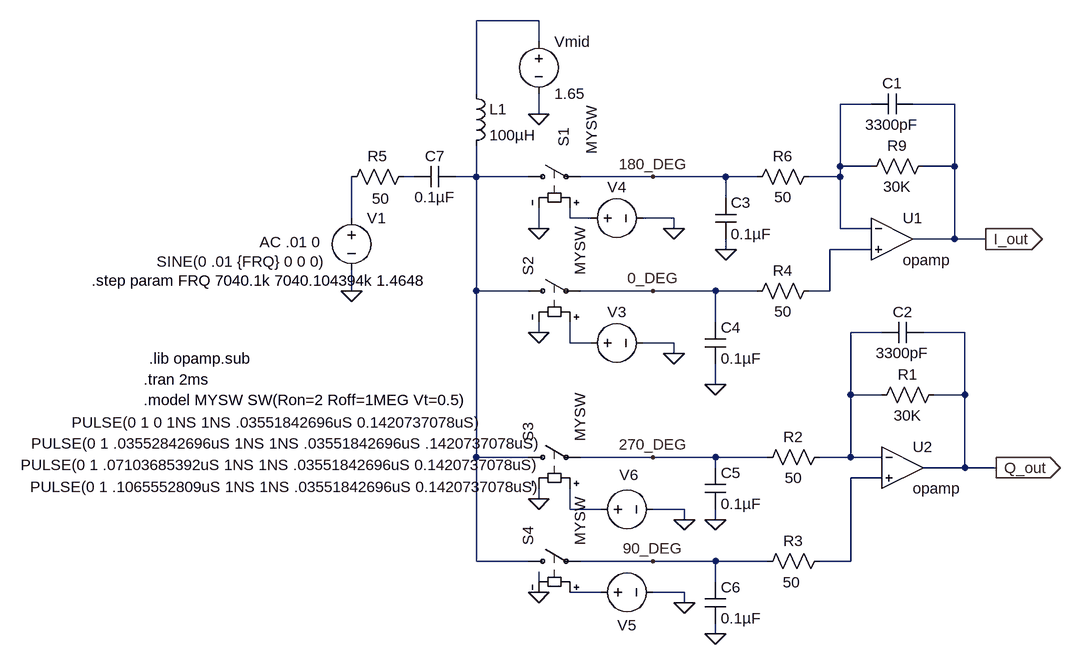
[diagram p0: schematic mixer_and_amplifier.asc]
mixer_and_amplifier.asc, the LTspice schematic file:
Version 4
SHEET 1 2336 848
WIRE -480 -288 -576 -288
WIRE -480 -256 -480 -288
WIRE -576 -176 -576 -288
WIRE 32 -160 -16 -160
WIRE 160 -160 96 -160
WIRE -480 -144 -480 -176
WIRE -16 -64 -16 -160
WIRE 32 -64 -16 -64
WIRE 160 -64 160 -160
WIRE 160 -64 112 -64
WIRE -672 -48 -688 -48
WIRE -576 -48 -576 -96
WIRE -576 -48 -608 -48
WIRE -496 -48 -576 -48
WIRE -304 -48 -416 -48
WIRE -192 -48 -304 -48
WIRE -144 -48 -192 -48
WIRE -16 -48 -16 -64
WIRE -16 -48 -64 -48
WIRE -192 -16 -192 -48
WIRE -768 16 -768 -48
WIRE -432 16 -432 0
WIRE -400 16 -432 16
WIRE -272 16 -320 16
WIRE -480 32 -480 0
WIRE -272 32 -272 16
WIRE -16 32 -16 -48
WIRE 32 32 -16 32
WIRE 160 48 160 -64
WIRE 160 48 96 48
WIRE 208 48 160 48
WIRE -192 64 -192 48
WIRE 32 64 -32 64
WIRE -768 128 -768 96
WIRE -576 128 -576 -48
WIRE -496 128 -576 128
WIRE -304 128 -416 128
WIRE -208 128 -304 128
WIRE -144 128 -208 128
WIRE -32 128 -32 64
WIRE -32 128 -64 128
WIRE -208 176 -208 128
WIRE -480 192 -480 176
WIRE 48 192 0 192
WIRE 176 192 112 192
WIRE -432 208 -432 176
WIRE -400 208 -432 208
WIRE -272 208 -320 208
WIRE -272 224 -272 208
WIRE -208 272 -208 240
WIRE 0 288 0 192
WIRE 48 288 0 288
WIRE 176 288 176 192
WIRE 176 288 128 288
WIRE -576 384 -576 128
WIRE -496 384 -576 384
WIRE -304 384 -416 384
WIRE -208 384 -304 384
WIRE -128 384 -208 384
WIRE 0 384 0 288
WIRE 0 384 -48 384
WIRE 48 384 0 384
WIRE -208 400 -208 384
WIRE 176 400 176 288
WIRE 176 400 112 400
WIRE 224 400 176 400
WIRE 48 416 0 416
WIRE -480 448 -480 432
WIRE -432 464 -432 432
WIRE -384 464 -432 464
WIRE -256 464 -304 464
WIRE -256 480 -256 464
WIRE -208 480 -208 464
WIRE -576 544 -576 384
WIRE -496 544 -576 544
WIRE -304 544 -416 544
WIRE -208 544 -304 544
WIRE -128 544 -208 544
WIRE 0 544 0 416
WIRE 0 544 -48 544
WIRE -480 576 -480 560
WIRE -208 576 -208 544
WIRE -384 592 -432 592
WIRE -256 592 -304 592
WIRE -256 608 -256 592
WIRE -208 656 -208 640
FLAG -304 128 0_DEG
FLAG -304 -48 180_DEG
FLAG -304 544 90_DEG
FLAG -304 384 270_DEG
FLAG -480 32 0
FLAG -480 192 0
FLAG -480 448 0
FLAG -480 592 0
FLAG -272 32 0
FLAG -272 224 0
FLAG -256 480 0
FLAG -256 608 0
FLAG -192 64 0
FLAG -208 272 0
FLAG -208 480 0
FLAG -208 656 0
FLAG -768 128 0
FLAG -480 -144 0
FLAG 208 48 I_out
IOPIN 208 48 Out
FLAG 224 400 Q_out
IOPIN 224 400 Out
SYMBOL res -32 368 R90
WINDOW 0 0 56 VBottom 2
WINDOW 3 32 56 VTop 2
SYMATTR InstName R2
SYMATTR Value 50
SYMATTR SpiceLine tol=1
SYMBOL res -32 528 R90
WINDOW 0 0 56 VBottom 2
WINDOW 3 33 59 VTop 2
SYMATTR InstName R3
SYMATTR Value 50
SYMATTR SpiceLine tol=1
SYMBOL res -48 112 R90
WINDOW 0 0 56 VBottom 2
WINDOW 3 32 56 VTop 2
SYMATTR InstName R4
SYMATTR Value 50
SYMATTR SpiceLine tol=1
SYMBOL res -48 -64 R90
WINDOW 0 0 56 VBottom 2
WINDOW 3 32 56 VTop 2
SYMATTR InstName R6
SYMATTR Value 50
SYMATTR SpiceLine tol=1]
SYMBOL cap 96 -176 R90
WINDOW 0 0 32 VBottom 2
WINDOW 3 32 32 VTop 2
SYMATTR InstName C1
SYMATTR Value 3300pF
SYMBOL cap -208 -16 R0
SYMATTR InstName C3
SYMATTR Value 0.1µF
SYMBOL cap -224 176 R0
SYMATTR InstName C4
SYMATTR Value 0.1µF
SYMBOL cap -224 400 R0
SYMATTR InstName C5
SYMATTR Value 0.1µF
SYMBOL cap -224 576 R0
SYMATTR InstName C6
SYMATTR Value 0.1µF
SYMBOL res 128 -80 R90
WINDOW 0 0 56 VBottom 2
WINDOW 3 32 56 VTop 2
SYMATTR InstName R9
SYMATTR Value 30K
SYMATTR SpiceLine tol=1
SYMBOL voltage -768 0 R0
WINDOW 123 -142 53 Left 2
WINDOW 39 0 0 Left 0
WINDOW 3 -300 83 Left 2
SYMATTR Value2 AC .01 0
SYMATTR Value SINE(0 .01 {FRQ} 0 0 0)
SYMATTR InstName V1
SYMBOL sw -512 -48 R270
WINDOW 3 34 113 Left 2
WINDOW 0 46 70 Left 2
SYMATTR Value MYSW
SYMATTR InstName S1
SYMBOL sw -512 128 R270
SYMATTR InstName S2
SYMATTR Value MYSW
SYMBOL sw -512 384 R270
SYMATTR InstName S3
SYMATTR Value MYSW
SYMBOL sw -512 544 R270
SYMATTR InstName S4
SYMATTR Value MYSW
SYMBOL voltage -416 208 R270
WINDOW 0 32 56 VTop 2
WINDOW 3 -107 -464 VBottom 2
WINDOW 123 0 0 Left 0
WINDOW 39 0 0 Left 0
SYMATTR InstName V3
SYMATTR Value PULSE(0 1 0 1NS 1NS .03551842696uS 0.1420737078uS)
SYMBOL voltage -416 16 R270
WINDOW 0 32 56 VTop 2
WINDOW 3 -364 -457 VBottom 2
WINDOW 123 0 0 Left 0
WINDOW 39 0 0 Left 0
SYMATTR InstName V4
SYMATTR Value PULSE(0 1 .07103685392uS 1NS 1NS .03551842696uS 0.1420737078uS)
SYMBOL voltage -400 592 R270
WINDOW 0 -66 56 VTop 2
WINDOW 3 245 -464 VBottom 2
WINDOW 123 0 0 Left 0
WINDOW 39 0 0 Left 0
SYMATTR InstName V5
SYMATTR Value PULSE(0 1 .03552842696uS 1NS 1NS .03551842696uS .1420737078uS)
SYMBOL voltage -400 464 R270
WINDOW 0 37 59 VTop 2
WINDOW 3 50 -465 VBottom 2
WINDOW 123 0 0 Left 0
WINDOW 39 0 0 Left 0
SYMATTR InstName V6
SYMATTR Value PULSE(0 1 .1065552809uS 1NS 1NS .03551842696uS 0.1420737078uS)
SYMBOL res -672 -64 R90
WINDOW 0 0 56 VBottom 2
WINDOW 3 34 51 VTop 2
SYMATTR InstName R5
SYMATTR Value 50
SYMBOL ind -592 -192 R0
SYMATTR InstName L1
SYMATTR Value 100µH
SYMBOL cap -608 -64 R90
WINDOW 0 0 32 VBottom 2
WINDOW 3 32 32 VTop 2
SYMATTR InstName C7
SYMATTR Value 0.1µF
SYMBOL OpAmps/opamp 64 -16 R0
SYMATTR InstName U1
SYMBOL cap 112 176 R90
WINDOW 0 0 32 VBottom 2
WINDOW 3 32 32 VTop 2
SYMATTR InstName C2
SYMATTR Value 3300pF
SYMBOL res 144 272 R90
WINDOW 0 0 56 VBottom 2
WINDOW 3 32 56 VTop 2
SYMATTR InstName R1
SYMATTR Value 30K
SYMATTR SpiceLine tol=1
SYMBOL OpAmps/opamp 80 336 R0
SYMATTR InstName U2
SYMBOL voltage -480 -272 R0
SYMATTR InstName Vmid
SYMATTR Value 1.65
SYMATTR SpiceLine Rser=10
TEXT -1088 296 Left 2 !.model MYSW SW(Ron=2 Roff=1MEG Vt=0.5)
TEXT -1088 264 Left 2 !.tran 2ms
TEXT -1168 112 Left 2 !.step param FRQ 7040.1k 7040.104394k 1.4648
TEXT -1080 232 Left 2 !.lib opamp.sub

The netlist it stands for:
* mixer_and_amplifier.asc
R2 N008 270_DEG 50 tol=1
R3 N010 90_DEG 50 tol=1
R4 N007 0_DEG 50 tol=1
R6 N002 180_DEG 50 tol=1]
C1 I_out N002 3300pF
C3 180_DEG 0 0.1µF
C4 0_DEG 0 0.1µF
C5 270_DEG 0 0.1µF
C6 90_DEG 0 0.1µF
R9 I_out N002 30K tol=1
V1 N005 0 SINE(0 .01 {FRQ} 0 0 0) AC .01 0
S1 N004 180_DEG N006 0 MYSW
S2 N004 0_DEG N009 0 MYSW
S3 N004 270_DEG N011 0 MYSW
S4 N004 90_DEG N013 0 MYSW
V3 N009 0 PULSE(0 1 0 1NS 1NS .03551842696uS 0.1420737078uS)
V4 N006 0 PULSE(0 1 .07103685392uS 1NS 1NS .03551842696uS 0.1420737078uS)
V5 N013 0 PULSE(0 1 .03552842696uS 1NS 1NS .03551842696uS .1420737078uS)
V6 N011 0 PULSE(0 1 .1065552809uS 1NS 1NS .03551842696uS 0.1420737078uS)
R5 N003 N005 50
L1 N001 N004 100µH
C7 N004 N003 0.1µF
XU1 N002 N007 I_out opamp Aol=100K GBW=10Meg  ; pins invin noninvin out
C2 Q_out N008 3300pF
R1 Q_out N008 30K tol=1
XU2 N008 N010 Q_out opamp Aol=100K GBW=10Meg  ; pins invin noninvin out
Vmid N001 0 1.65 Rser=10
.model MYSW SW(Ron=2 Roff=1MEG Vt=0.5)
.tran 2ms
.step param FRQ 7040.1k 7040.104394k 1.4648
.lib opamp.sub
.backanno
.end